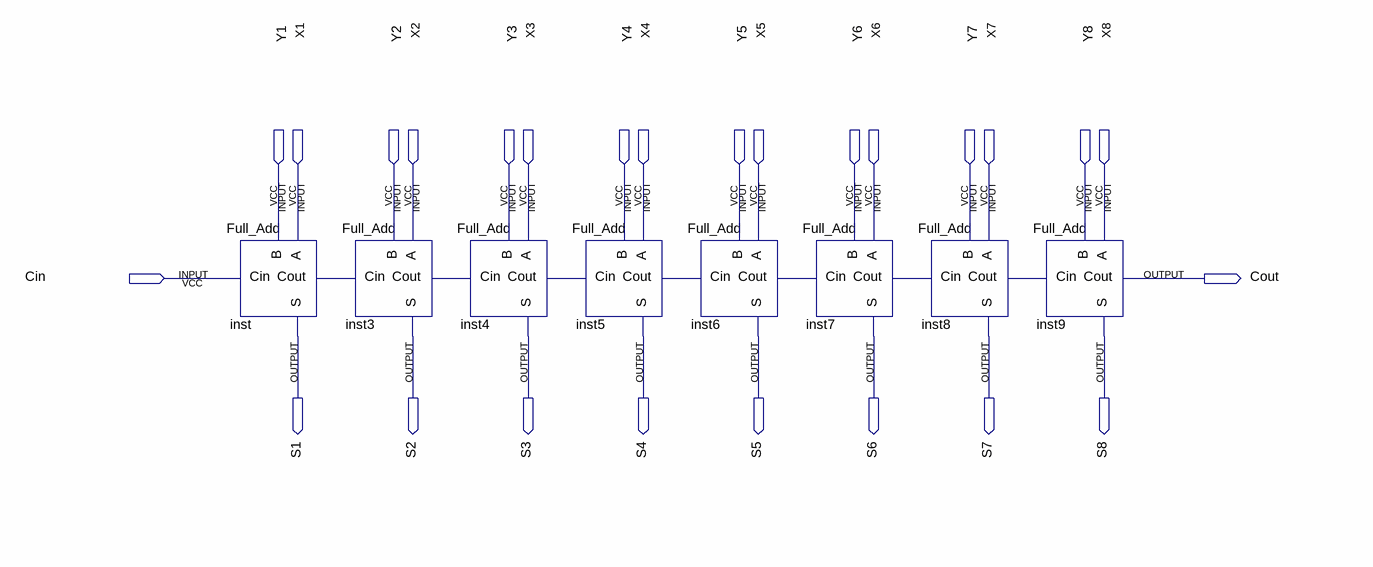
[diagram p0: schematic sheet]
// Quartus schematic 8_bit_add.bdf as structural Verilog: 8 symbols, 26 pins
module \8_bit_add  (
  input  Y1,
  input  X1,
  input  Y2,
  input  X2,
  input  Y3,
  input  X3,
  input  Y4,
  input  X4,
  input  Y5,
  input  X5,
  input  Y6,
  input  X6,
  input  Y7,
  input  X7,
  input  Y8,
  input  X8,
  input  Cin,
  output Cout,
  output S1,
  output S2,
  output S3,
  output S4,
  output S5,
  output S6,
  output S7,
  output S8
);

  wire inst3_cout, inst4_cout, inst5_cout, inst6_cout, inst7_cout, inst8_cout, inst_cout;

  Full_Add inst (.A(X1), .B(Y1), .Cin(Cin), .S(S1), .Cout(inst_cout));
  Full_Add inst3 (.A(X2), .B(Y2), .Cin(inst_cout), .S(S2), .Cout(inst3_cout));
  Full_Add inst4 (.A(X3), .B(Y3), .Cin(inst3_cout), .S(S3), .Cout(inst4_cout));
  Full_Add inst5 (.A(X4), .B(Y4), .Cin(inst4_cout), .S(S4), .Cout(inst5_cout));
  Full_Add inst6 (.A(X5), .B(Y5), .Cin(inst5_cout), .S(S5), .Cout(inst6_cout));
  Full_Add inst7 (.A(X6), .B(Y6), .Cin(inst6_cout), .S(S6), .Cout(inst7_cout));
  Full_Add inst8 (.A(X7), .B(Y7), .Cin(inst7_cout), .S(S7), .Cout(inst8_cout));
  Full_Add inst9 (.A(X8), .B(Y8), .Cin(inst8_cout), .S(S8), .Cout(Cout));
endmodule
